# EAGLE design Gooligum_BaseDev_r16 (EAGLE 5.11)

## Sheet 1 of 4
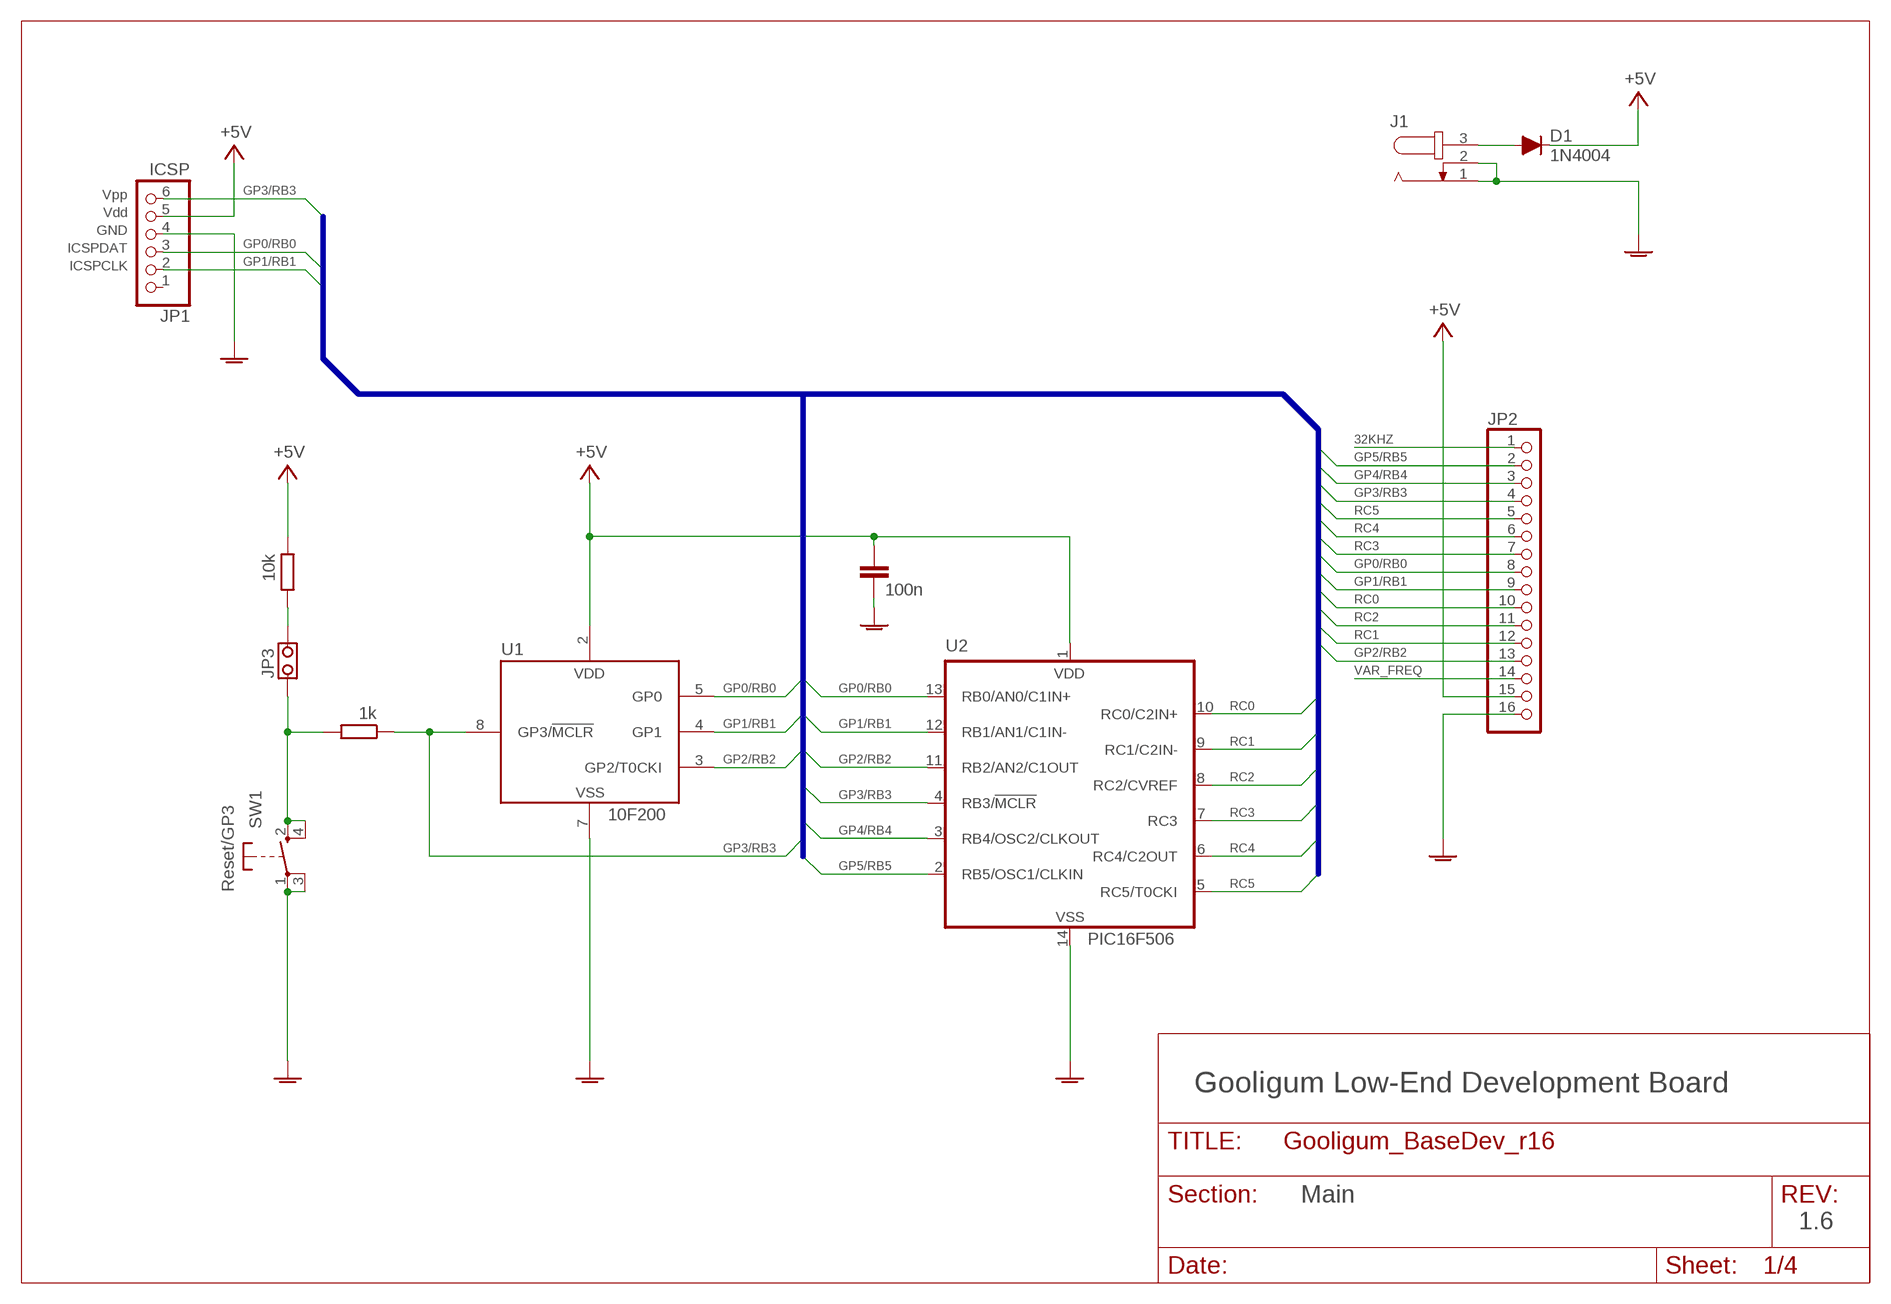
[diagram p0: schematic, sheet 1]

### Parts
C1  100n  C-EU050-024X044  [C050-024X044]
D1  1N4004  [DO41-10]
J1  JACK-PLUG0  [SPC4077]
JP1  ICSP  PINHD-1X6/90  [1X06/90]
JP2  PINHD-1X16  [1X16]
JP3  JP1Q  [JP1]
R1  10k  R-EU_0204/7  [0204/7]
R2  1k  R-EU_0204/7  [0204/7]
SW1  ETLS  [ELTS-6]
U1  10F200  PIC10F200-I/P  [DIL8]
U2  PIC16F506  PIC16F506-I/P  [DIL14]

### Nets
32KHZ: JP2.1 ; also sheet 3
+5V: C1.1 D1.C JP1.5 JP2.15 R1.1 U1.2(VDD1) U2.1(VDD) ; also sheet 2,3,4
GND: C1.2 J1.1 J1.2 JP1.4 JP2.16 SW1.1(T1) SW1.3(T3) U1.7(VSS1) U2.14(VSS) ; supply symbol labelled GNDA ; also sheet 2,3,4
GP0/RB0: JP1.3 JP2.8 U1.5(GP0) U2.13(RB0/AN0/C1IN+) ; also sheet 2,4
GP1/RB1: JP1.2 JP2.9 U1.4(GP1) U2.12(RB1/AN1/C1IN-) ; also sheet 2,4
GP2/RB2: JP2.13 U1.3(GP2/T0CKI) U2.11(RB2/AN2/C1OUT) ; also sheet 2,3,4
GP3/RB3: JP1.6 JP2.4 R2.1 U1.8(GP3/!MCLR) U2.4(RB3/!MCLR)
GP4/RB4: JP2.3 U2.3(RB4/OSC2/CLKOUT) ; also sheet 2,3,4
GP5/RB5: JP2.2 U2.2(RB5/OSC1/CLKIN) ; also sheet 2,3
N$1: JP3.1 R2.2 SW1.2(T2) SW1.4(T4)
N$5: JP3.2 R1.2
N$55: D1.A J1.3
RC0: JP2.10 U2.10(RC0/C2IN+) ; also sheet 2,4
RC1: JP2.12 U2.9(RC1/C2IN-) ; also sheet 2
RC2: JP2.11 U2.8(RC2/CVREF) ; also sheet 2
RC3: JP2.7 U2.7(RC3) ; also sheet 2
RC4: JP2.6 U2.6(RC4/C2OUT) ; also sheet 2,4
RC5: JP2.5 U2.5(RC5/T0CKI) ; also sheet 2,4
VAR_FREQ: JP2.14 ; also sheet 4
Unconnected: JP1.1

### Buses
GP0/RB0,GP1/RB1,GP2/RB2,GP3/RB3,GP4/RB4,GP5/RB5,RC0,RC1,RC2,RC3,RC4,RC5

### Notes on the sheet
- Vpp
- Vdd
- GND
- ICSPDAT
- ICSPCLK
- Reset/GP3
- Gooligum Low-End Development Board
- Main
- 1.6

## Sheet 2 of 4
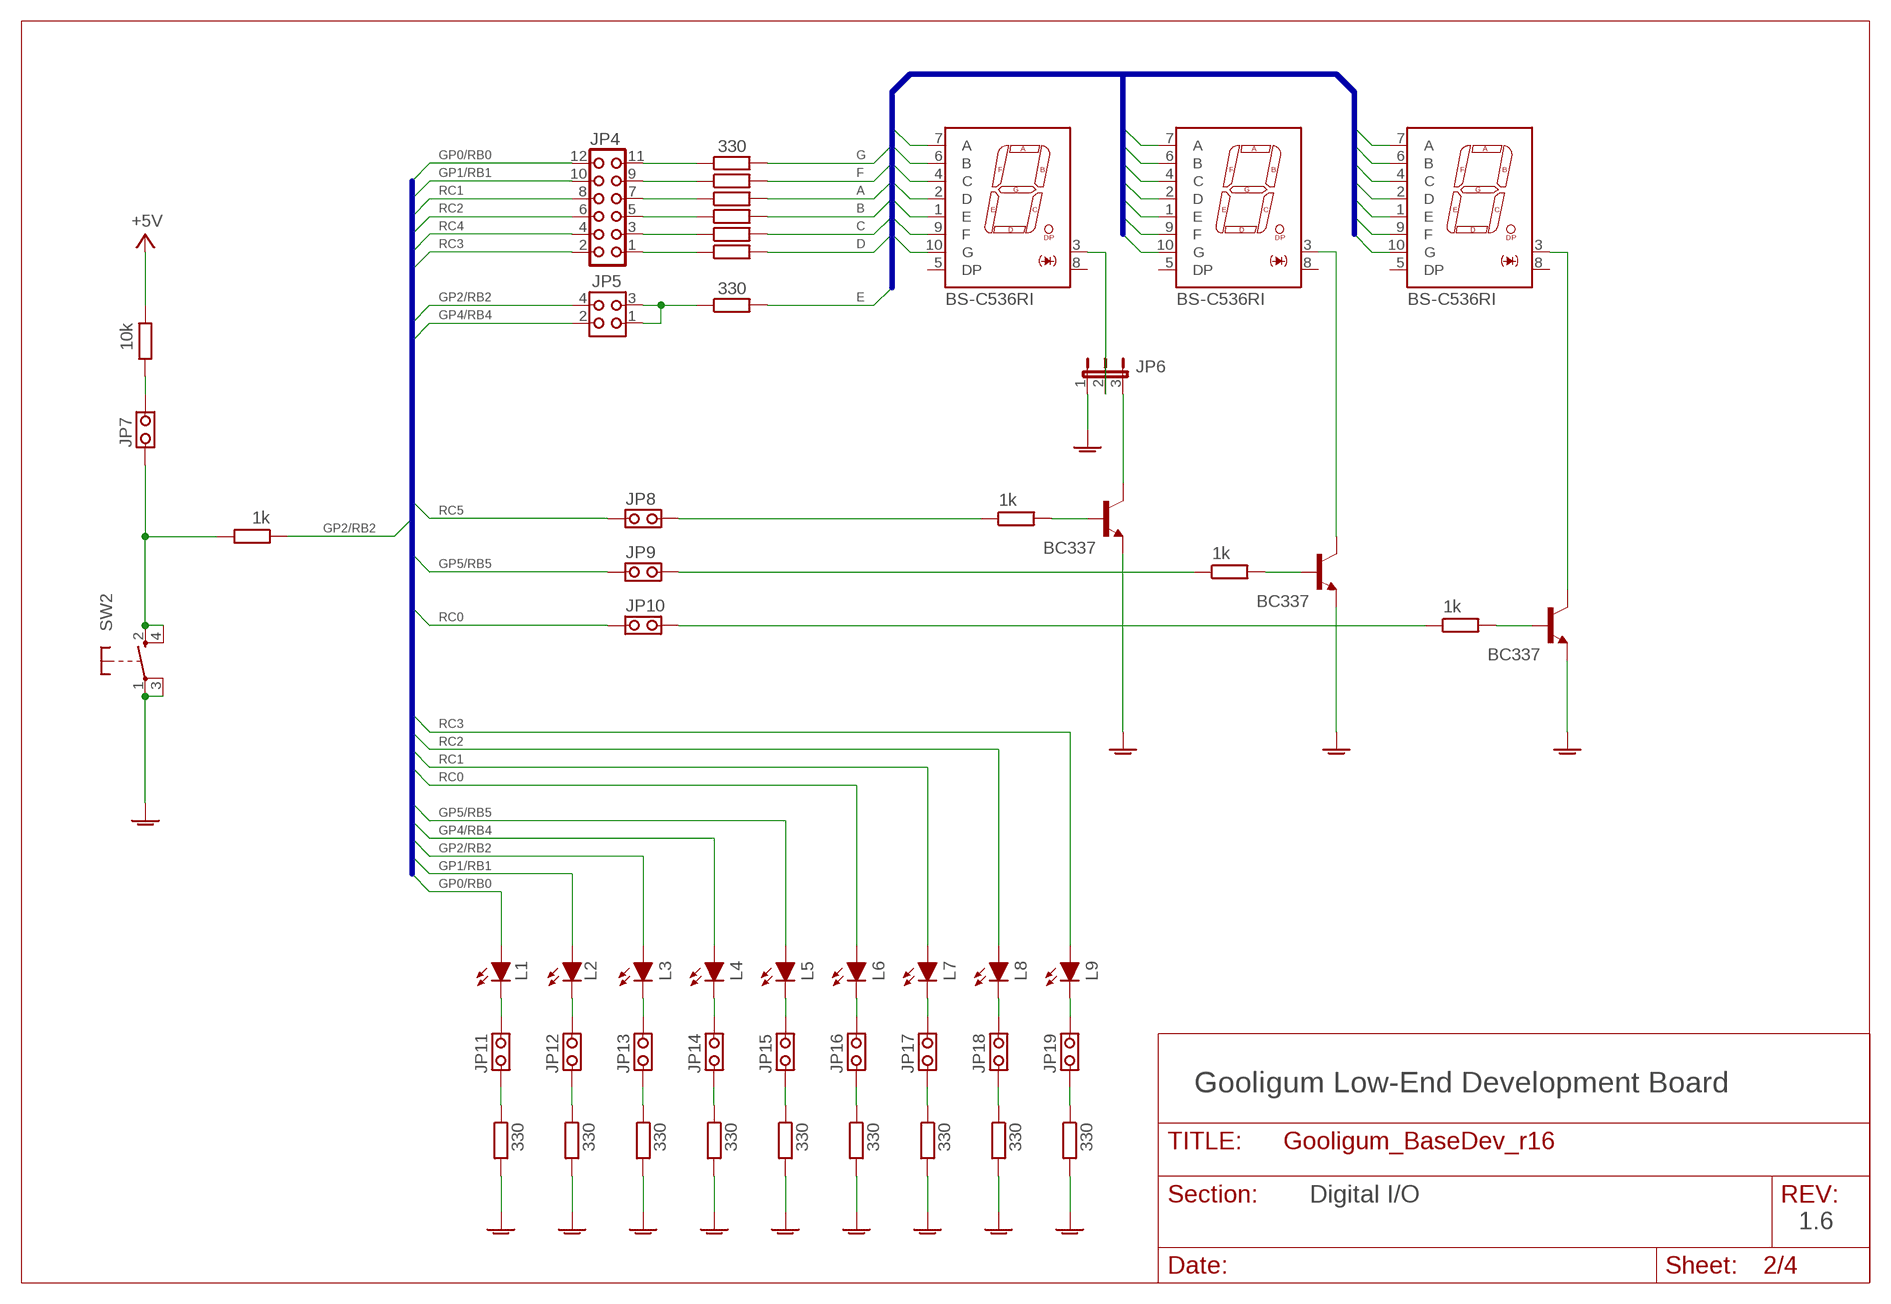
[diagram p1: schematic, sheet 2]

### Parts
DSP1  BS-C536RI  [BS-C536RI]
DSP2  BS-C536RI  [BS-C536RI]
DSP3  BS-C536RI  [BS-C536RI]
JP4  JP6Q  [JP6Q]
JP5  JP2Q  [JP2Q]
JP6  JP2E  [JP2]
JP7  JP1Q  [JP1]
JP8  JP1Q  [JP1]
JP9  JP1Q  [JP1]
JP10  JP1Q  [JP1]
JP11  JP1Q  [JP1]
JP12  JP1Q  [JP1]
JP13  JP1Q  [JP1]
JP14  JP1Q  [JP1]
JP15  JP1Q  [JP1]
JP16  JP1Q  [JP1]
JP17  JP1Q  [JP1]
JP18  JP1Q  [JP1]
JP19  JP1Q  [JP1]
L1  LED5MM  [LED5MM]
L2  LED5MM  [LED5MM]
L3  LED5MM  [LED5MM]
L4  LED5MM  [LED5MM]
L5  LED5MM  [LED5MM]
L6  LED5MM  [LED5MM]
L7  LED5MM  [LED5MM]
L8  LED5MM  [LED5MM]
L9  LED5MM  [LED5MM]
Q1  BC337  BC548  [TO92-EBC]
Q2  BC337  BC548  [TO92-EBC]
Q3  BC337  BC548  [TO92-EBC]
R3  330  R-EU_0204/7  [0204/7]
R4  330  R-EU_0204/7  [0204/7]
R5  330  R-EU_0204/7  [0204/7]
R6  330  R-EU_0204/7  [0204/7]
R7  330  R-EU_0204/7  [0204/7]
R8  330  R-EU_0204/7  [0204/7]
R9  330  R-EU_0204/7  [0204/7]
R10  10k  R-EU_0204/7  [0204/7]
R11  1k  R-EU_0204/7  [0204/7]
R12  1k  R-EU_0204/7  [0204/7]
R13  1k  R-EU_0204/7  [0204/7]
R14  1k  R-EU_0204/7  [0204/7]
R15  330  R-EU_0204/7  [0204/7]
R16  330  R-EU_0204/7  [0204/7]
R17  330  R-EU_0204/7  [0204/7]
R18  330  R-EU_0204/7  [0204/7]
R19  330  R-EU_0204/7  [0204/7]
R20  330  R-EU_0204/7  [0204/7]
R21  330  R-EU_0204/7  [0204/7]
R22  330  R-EU_0204/7  [0204/7]
R23  330  R-EU_0204/7  [0204/7]
SW2  ETLS  [ELTS-6]

### Nets
+5V: R10.1 ; also sheet 1,3,4
A: DSP1.7(A) DSP2.7(A) DSP3.7(A) R5.2
B: DSP1.6(B) DSP2.6(B) DSP3.6(B) R6.2
C: DSP1.4(C) DSP2.4(C) DSP3.4(C) R7.2
D: DSP1.2(D) DSP2.2(D) DSP3.2(D) R8.2
E: DSP1.1(E) DSP2.1(E) DSP3.1(E) R9.2
F: DSP1.9(F) DSP2.9(F) DSP3.9(F) R4.2
G: DSP1.10(G) DSP2.10(G) DSP3.10(G) R3.2
GND: JP6.1 Q1.E Q2.E Q3.E R15.2 R16.2 R17.2 R18.2 R19.2 R20.2 R21.2 R22.2 R23.2 SW2.1(T1) SW2.3(T3) ; supply symbol labelled GNDA ; also sheet 1,3,4
GP0/RB0: JP4.12 L1.A ; also sheet 1,4
GP1/RB1: JP4.10 L2.A ; also sheet 1,4
GP2/RB2: JP5.4 L3.A R12.1 ; also sheet 1,3,4
GP4/RB4: JP5.2 L4.A ; also sheet 1,3,4
GP5/RB5: JP9.1 L5.A ; also sheet 1,3
N$2: JP11.1 L1.K(C)
N$3: JP12.1 L2.K(C)
N$4: JP7.1 R12.2 SW2.2(T2) SW2.4(T4)
N$6: JP13.1 L3.K(C)
N$7: JP11.2 R15.1
N$8: JP12.2 R16.1
N$9: JP13.2 R17.1
N$10: JP7.2 R10.2
N$19: JP4.11 R3.1
N$20: JP4.9 R4.1
N$21: JP4.7 R5.1
N$22: JP4.5 R6.1
N$23: JP4.3 R7.1
N$24: JP4.1 R8.1
N$25: JP5.1 JP5.3 R9.1
N$26: DSP1.3(K) JP6.2
N$27: JP6.3 Q1.C
N$28: JP8.2 R11.1
N$29: Q1.B R11.2
N$30: DSP2.3(K) Q2.C
N$31: JP9.2 R13.1
N$32: Q2.B R13.2
N$33: DSP3.3(K) Q3.C
N$34: JP10.2 R14.1
N$35: Q3.B R14.2
N$38: JP16.1 L6.K(C)
N$39: JP16.2 R20.1
N$40: JP17.1 L7.K(C)
N$41: JP17.2 R21.1
N$42: JP18.1 L8.K(C)
N$43: JP18.2 R22.1
N$44: JP19.1 L9.K(C)
N$45: JP19.2 R23.1
N$46: JP14.2 R18.1
N$47: JP14.1 L4.K(C)
N$48: JP15.2 R19.1
N$49: JP15.1 L5.K(C)
RC0: JP10.1 L6.A ; also sheet 1,4
RC1: JP4.8 L7.A ; also sheet 1
RC2: JP4.6 L8.A ; also sheet 1
RC3: JP4.2 L9.A ; also sheet 1
RC4: JP4.4 ; also sheet 1,4
RC5: JP8.1 ; also sheet 1,4
Unconnected: DSP1.5(DP) DSP1.8(K) DSP2.5(DP) DSP2.8(K) DSP3.5(DP) DSP3.8(K)

### Buses
GP0/RB0,GP1/RB1,GP2/RB2,GP3/RB3,GP4/RB4,GP5/RB5,RC0,RC1,RC2,RC3,RC4,RC5
A,B,C,D,E,F,G

### Notes on the sheet
- Gooligum Low-End Development Board
- Digital I/O
- 1.6

## Sheet 3 of 4
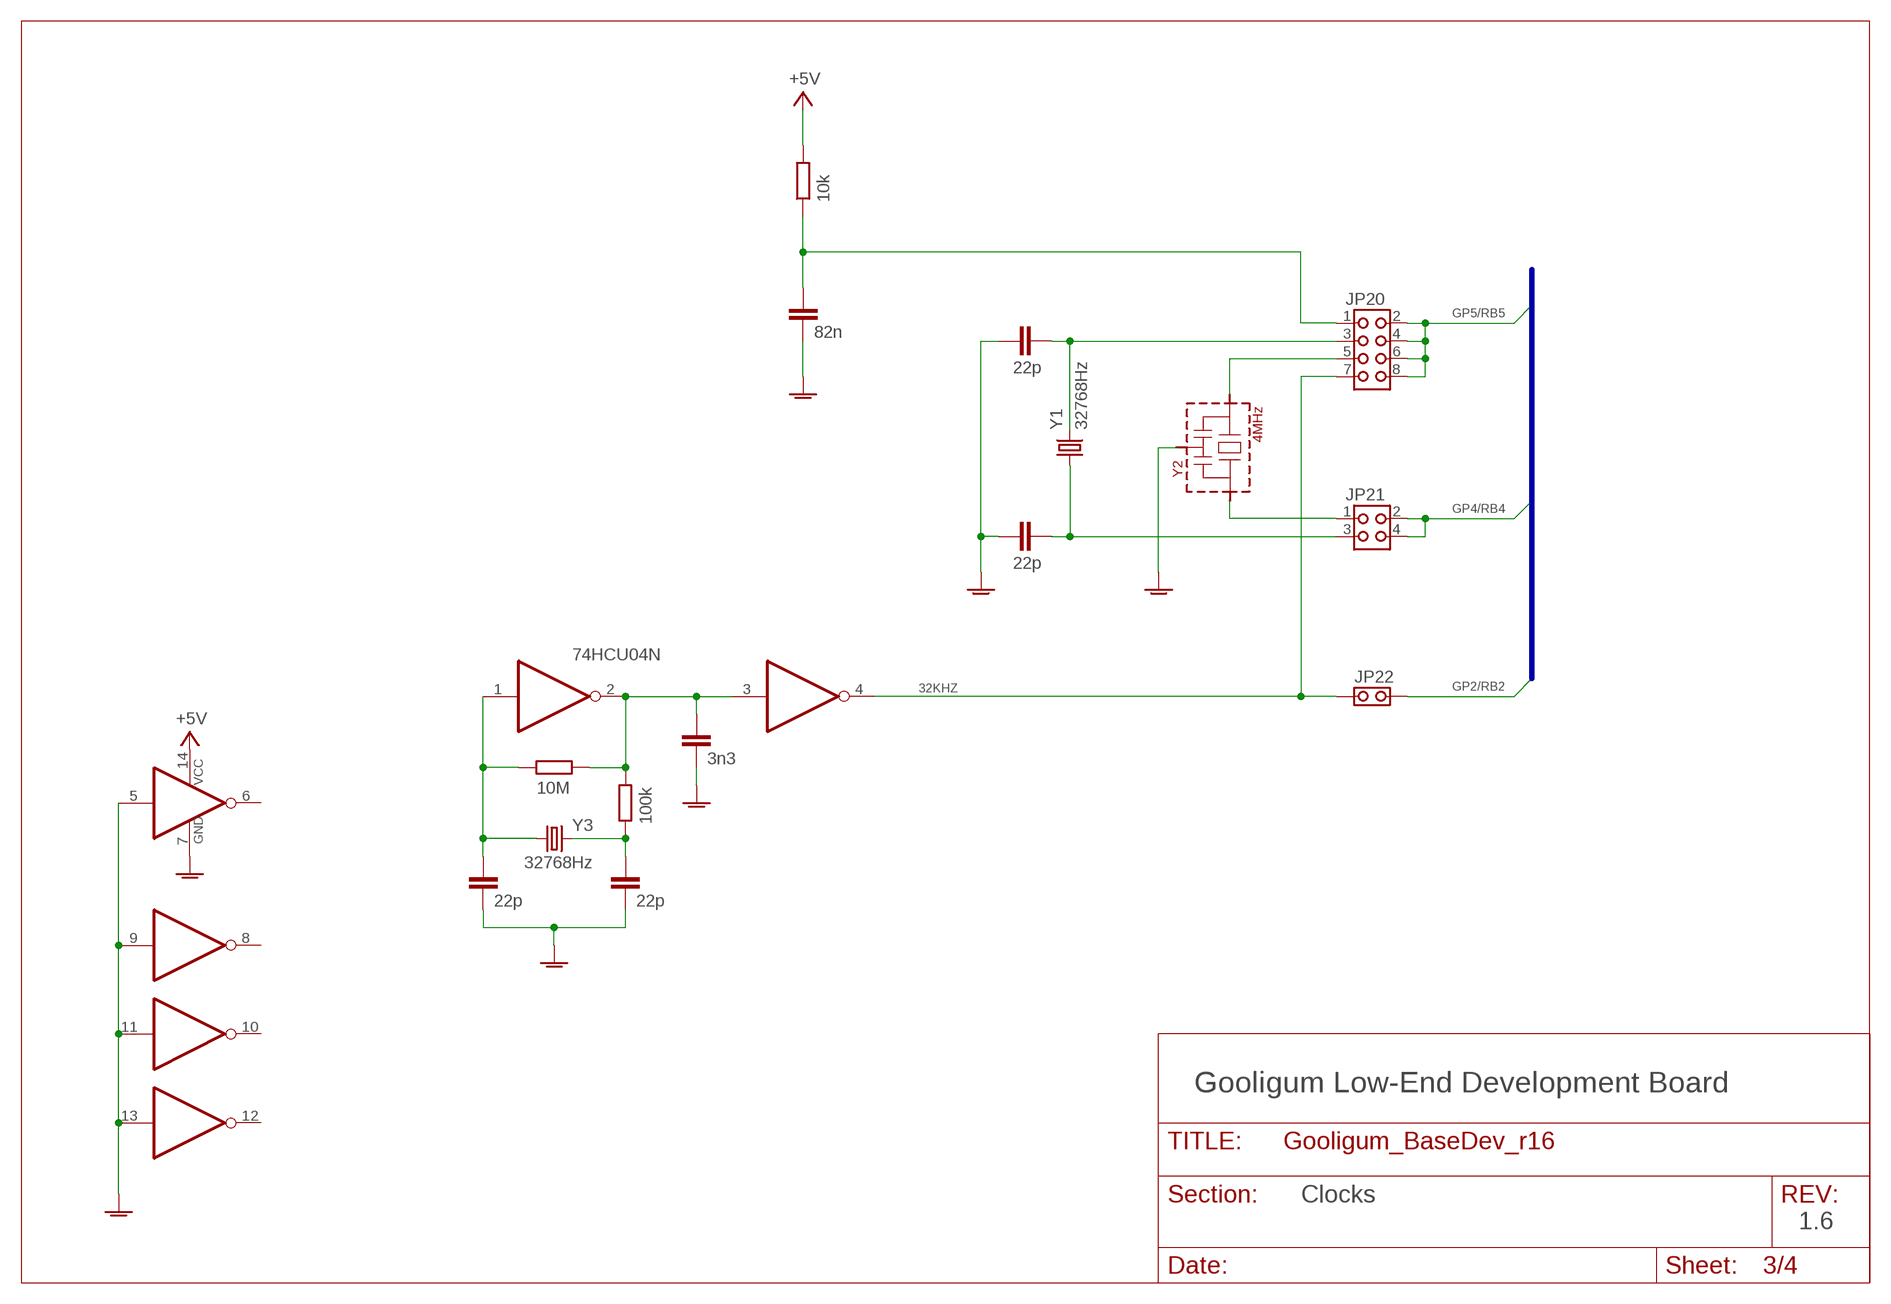
[diagram p2: schematic, sheet 3]

### Parts
C2  82n  C-EU050-025X075  [C050-025X075]
C3  22p  C-EU025-025X050  [C025-025X050]
C4  22p  C-EU025-025X050  [C025-025X050]
C5  3n3  C-EU050-025X075  [C050-025X075]
C6  22p  C-EU025-025X050  [C025-025X050]
C7  22p  C-EU025-025X050  [C025-025X050]
IC1  74HCU04N  74HC04N  [DIL14]
JP20  JP4Q  [JP4Q]
JP21  JP2Q  [JP2Q]
JP22  JP1Q  [JP1]
R24  10k  R-EU_0204/7  [0204/7]
R25  10M  R-EU_0204/7  [0204/7]
R26  100k  R-EU_0204/7  [0204/7]
Y1  32768Hz  CRYSTALTC26H  [TC26H]
Y2  4MHz  CSTLS_G*  [CSTLS_G9]
Y3  32768Hz  CRYSTALTC26H  [TC26H]

### Nets
32KHZ: IC1.4(B:O) JP20.7 JP22.1 ; also sheet 1
+5V: IC1.14(P:VCC) R24.2 ; also sheet 1,2,4
GND: C2.2 C3.1 C4.1 C5.2 C6.2 C7.2 IC1.5(C:I) IC1.7(P:GND) IC1.9(D:I) IC1.11(E:I) IC1.13(F:I) Y2.2(VSS) ; supply symbol labelled GNDA ; also sheet 1,2,4
GP2/RB2: JP22.2 ; also sheet 1,2,4
GP4/RB4: JP21.2 JP21.4 ; also sheet 1,2,4
GP5/RB5: JP20.2 JP20.4 JP20.6 JP20.8 ; also sheet 1,2
N$11: C5.1 IC1.2(A:O) IC1.3(B:I) R25.2 R26.2
N$12: C6.1 IC1.1(A:I) R25.1 Y3.1
N$13: C7.1 R26.1 Y3.2
N$14: C4.2 JP21.3 Y1.1
N$15: C2.1 JP20.1 R24.1
N$16: C3.2 JP20.3 Y1.2
N$17: JP21.1 Y2.3
N$18: JP20.5 Y2.1
Unconnected: IC1.6(C:O) IC1.8(D:O) IC1.10(E:O) IC1.12(F:O)

### Buses
GP0/RB0,GP1/RB1,GP2/RB2,GP3/RB3,GP4/RB4,GP5/RB5,RC0,RC1,RC2,RC3,RC4,RC5

### Notes on the sheet
- Gooligum Low-End Development Board
- Clocks
- 1.6

## Sheet 4 of 4
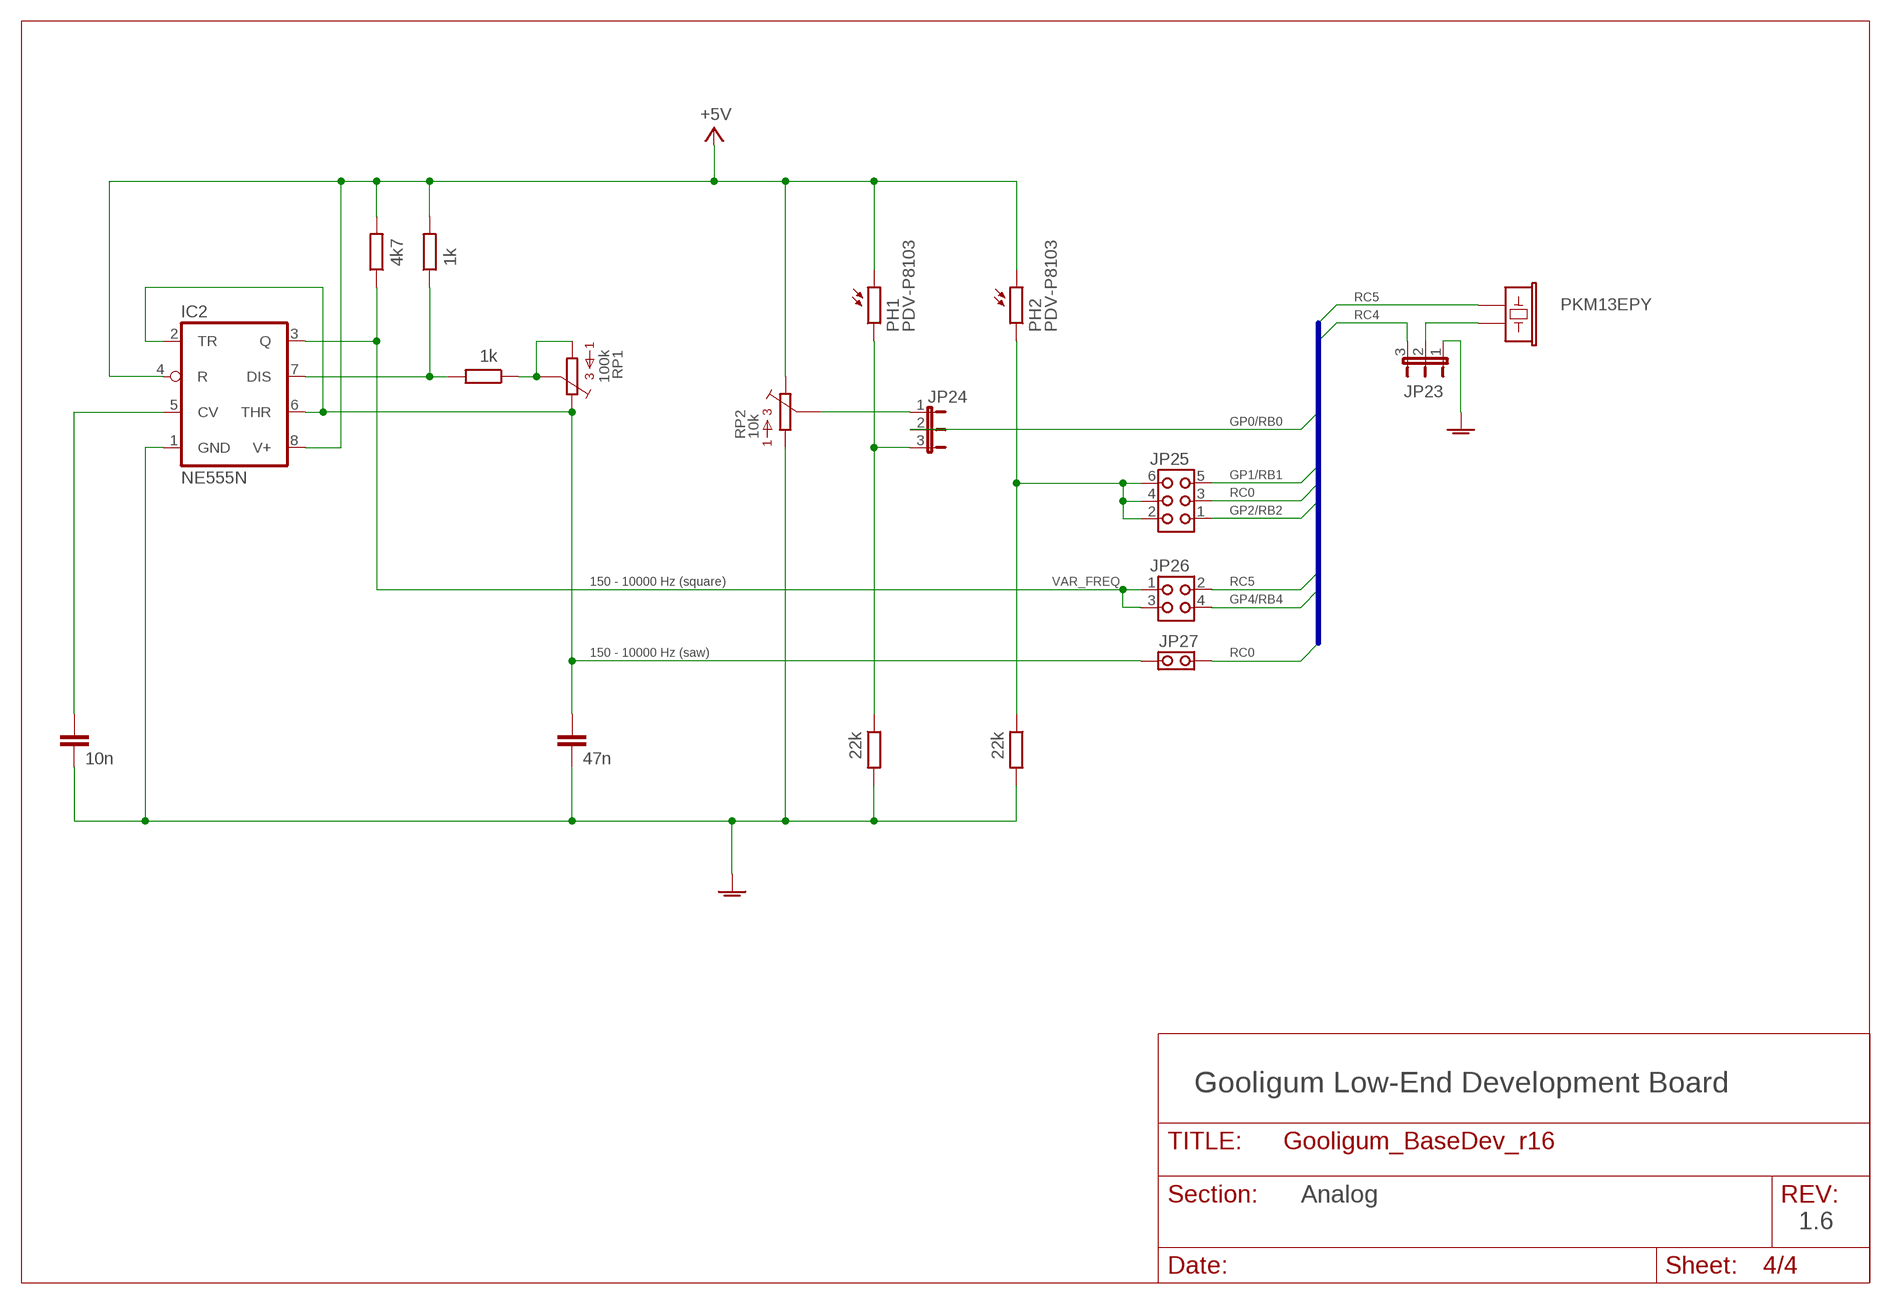
[diagram p3: schematic, sheet 4]

### Parts
C8  10n  C-EU025-025X050  [C025-025X050]
C9  47n  C-EU025-025X050  [C025-025X050]
IC2  NE555N  [DIL08]
JP23  JP2E  [JP2]
JP24  JP2E  [JP2]
JP25  JP3Q  [JP3Q]
JP26  JP2Q  [JP2Q]
JP27  JP1Q  [JP1]
PH1  PDV-P8103  [PDV-P8103]
PH2  PDV-P8103  [PDV-P8103]
R27  4k7  R-EU_0204/7  [0204/7]
R28  1k  R-EU_0204/7  [0204/7]
R29  1k  R-EU_0204/7  [0204/7]
R30  22k  R-EU_0204/7  [0204/7]
R31  22k  R-EU_0204/7  [0204/7]
RP1  100k  3352T  [3352T]
RP2  10k  3352T  [3352T]
SP1  PKM13EPY  [PKM13EPY]

### Nets
+5V: IC2.4(R) IC2.8(V+) PH1.1 PH2.1 R27.2 R28.2 RP2.P$3 ; also sheet 1,2,3
GND: C8.2 C9.2 IC2.1(GND) JP23.1 R30.2 R31.2 RP2.P$1 ; also sheet 1,2,3
GP0/RB0: JP24.2 ; also sheet 1,2
GP1/RB1: JP25.5 ; also sheet 1,2
GP2/RB2: JP25.1 ; also sheet 1,2,3
GP4/RB4: JP26.4 ; also sheet 1,2,3
N$36: JP24.3 PH1.2 R30.1
N$37: JP24.1 RP2.P$2
N$50: JP23.2 SP1.P$2
N$51: JP25.2 JP25.4 JP25.6 PH2.2 R31.1
N$52: C8.1 IC2.5(CV)
N$53: R29.1 RP1.P$1 RP1.P$2
N$54: C9.1 IC2.2(TR) IC2.6(THR) JP27.1 RP1.P$3
N$56: IC2.7(DIS) R28.1 R29.2
RC0: JP25.3 JP27.2 ; also sheet 1,2
RC4: JP23.3 ; also sheet 1,2
RC5: JP26.2 SP1.P$1 ; also sheet 1,2
VAR_FREQ: IC2.3(Q) JP26.1 JP26.3 R27.1 ; also sheet 1

### Buses
GP0/RB0,GP1/RB1,GP2/RB2,GP3/RB3,GP4/RB4,GP5/RB5,RC0,RC1,RC2,RC3,RC4,RC5

### Notes on the sheet
- 150 - 10000 Hz (square)
- 150 - 10000 Hz (saw)
- Gooligum Low-End Development Board
- Analog
- 1.6

## Library data of the parts
C1 = resistor:C-EU: CAPACITOR, European symbol
C2-C9 = rcl:C-EU: CAPACITOR, European symbol
D1 = diode:1N4004: DIODE general purpose rectifier, 1 A
DSP1-DSP3 = led:BS-C536RI: Bright LED Electronics Corp BS-C536R1 0.52inch 7-segment display Direct drive common cathode
IC1 = 74xx-eu:74*04: Hex INVERTER
IC2 = linear:*555: TIMER
J1 = con-jack_short-slots:JACK-PLUG: DC POWER JACK Power Jack, DC, Right Angle, Through Hole, Rated 5A at 16VDC, PC Terminals Distributor: Farnell (www.Farnell.de) Drawing: 84N1161.pdf / 84N1162.pdf Manufacturer: SPC Technology (www.spctechnology.com) Type: SPC4077 / SPC 4078; OC_FARNELL: unknown; OC_NEWARK: unknown
JP1 = pinhead_thinpads:PINHD-1X6: PIN HEADER
JP2 = pinhead_thinpads:PINHD-1X16: PIN HEADER
JP3 JP7-JP19 JP22 JP27 = jumper:JP1Q: JUMPER
JP4 = jumper:JP6Q: JUMPER
JP5 JP21 JP26 = jumper:JP2Q: JUMPER
JP6 JP23 JP24 = jumper:JP2E: JUMPER
JP20 = jumper:JP4Q: JUMPER
JP25 = jumper:JP3Q: JUMPER
L1-L9 = led:LED: LED OSRAM: - CHIPLED LG R971, LG N971, LY N971, LG Q971, LY Q971, LO R971, LY R971 LH N974, LH R974 LS Q976, LO Q976, LY Q976 LO Q996 - Hyper CHIPLED LW Q18S LB Q993, LB Q99A, LB R99A - SideLED LS A670, LO A670, LY A670, LG A670, LP A670 LB A673, LV A673, LT A673, LW A673 LH A674 LY A675 LS A676, LA A676, LO A676, LY A676, LW A676 LS A679, LY A679, LG A679 - Hyper Micro SIDELED® LS Y876, LA Y876, LO Y876, LY Y876 LT Y87S - SmartLED LW L88C, LW L88S LB L89C, LB L89S, LG L890 LS L89K, LO L89K, LY L89K LS L896, LA L896, LO L896, LY L896 - TOPLED LS T670, LO T670, LY T670, LG T670, LP T670 LSG T670, LSP T670, LSY T670, LOP T670, LYG T670 LG T671, LOG T671, LSG T671 LB T673, LV T673, LT T673, LW T673 LH T674 LS T676, LA T676, LO T676, LY T676, LB T676, LH T676, LSB T676, LW T676 LB T67C, LV T67C, LT T67C, LS T67K, LO T67K, LY T67K, LW E67C LS E67B, LA E67B, LO E67B, LY E67B, LB E67C, LV E67C, LT E67C LW T67C LS T679, LY T679, LG T679 LS T770, LO T770, LY T770, LG T770, LP T770 LB T773, LV T773, LT T773, LW T773 LH T774 LS E675, LA E675, LY E675, LS T675 LS T776, LA T776, LO T776, LY T776, LB T776 LHGB T686 LT T68C, LB T68C - Hyper Mini TOPLED® LB M676 - Mini TOPLED Santana® LG M470 LS M47K, LO M47K, LY M47K Source: http://www.osram.convergy.de/
PH1 PH2 = photocell-EU:PDV-P8103: Advanced Photonix PDV-P8103
Q1-Q3 = transistor-npn:BC548*: NPN Transistor
R1-R31 = rcl:R-EU_: RESISTOR, European symbol
RP1 RP2 = BOURNS:3352: Bourns 3352 3/8" thumbwheel trimpots
SP1 = buzzer-murata:PKM13EPY
SW1 SW2 = switch-salecom:ETLS: PCB mount tact pushbutton switch
U1 = PIC10F20x:PIC10F20*: Microchip PIC10F200 and 10F202
U2 = pic16f6xx_14pin:PIC16F506
Y1 Y3 = crystal:CRYSTAL: CRYSTAL
Y2 = murata-resonators:CSTLS_G: Ceramic resonator 2.00 to 10.00 MHz

## Board
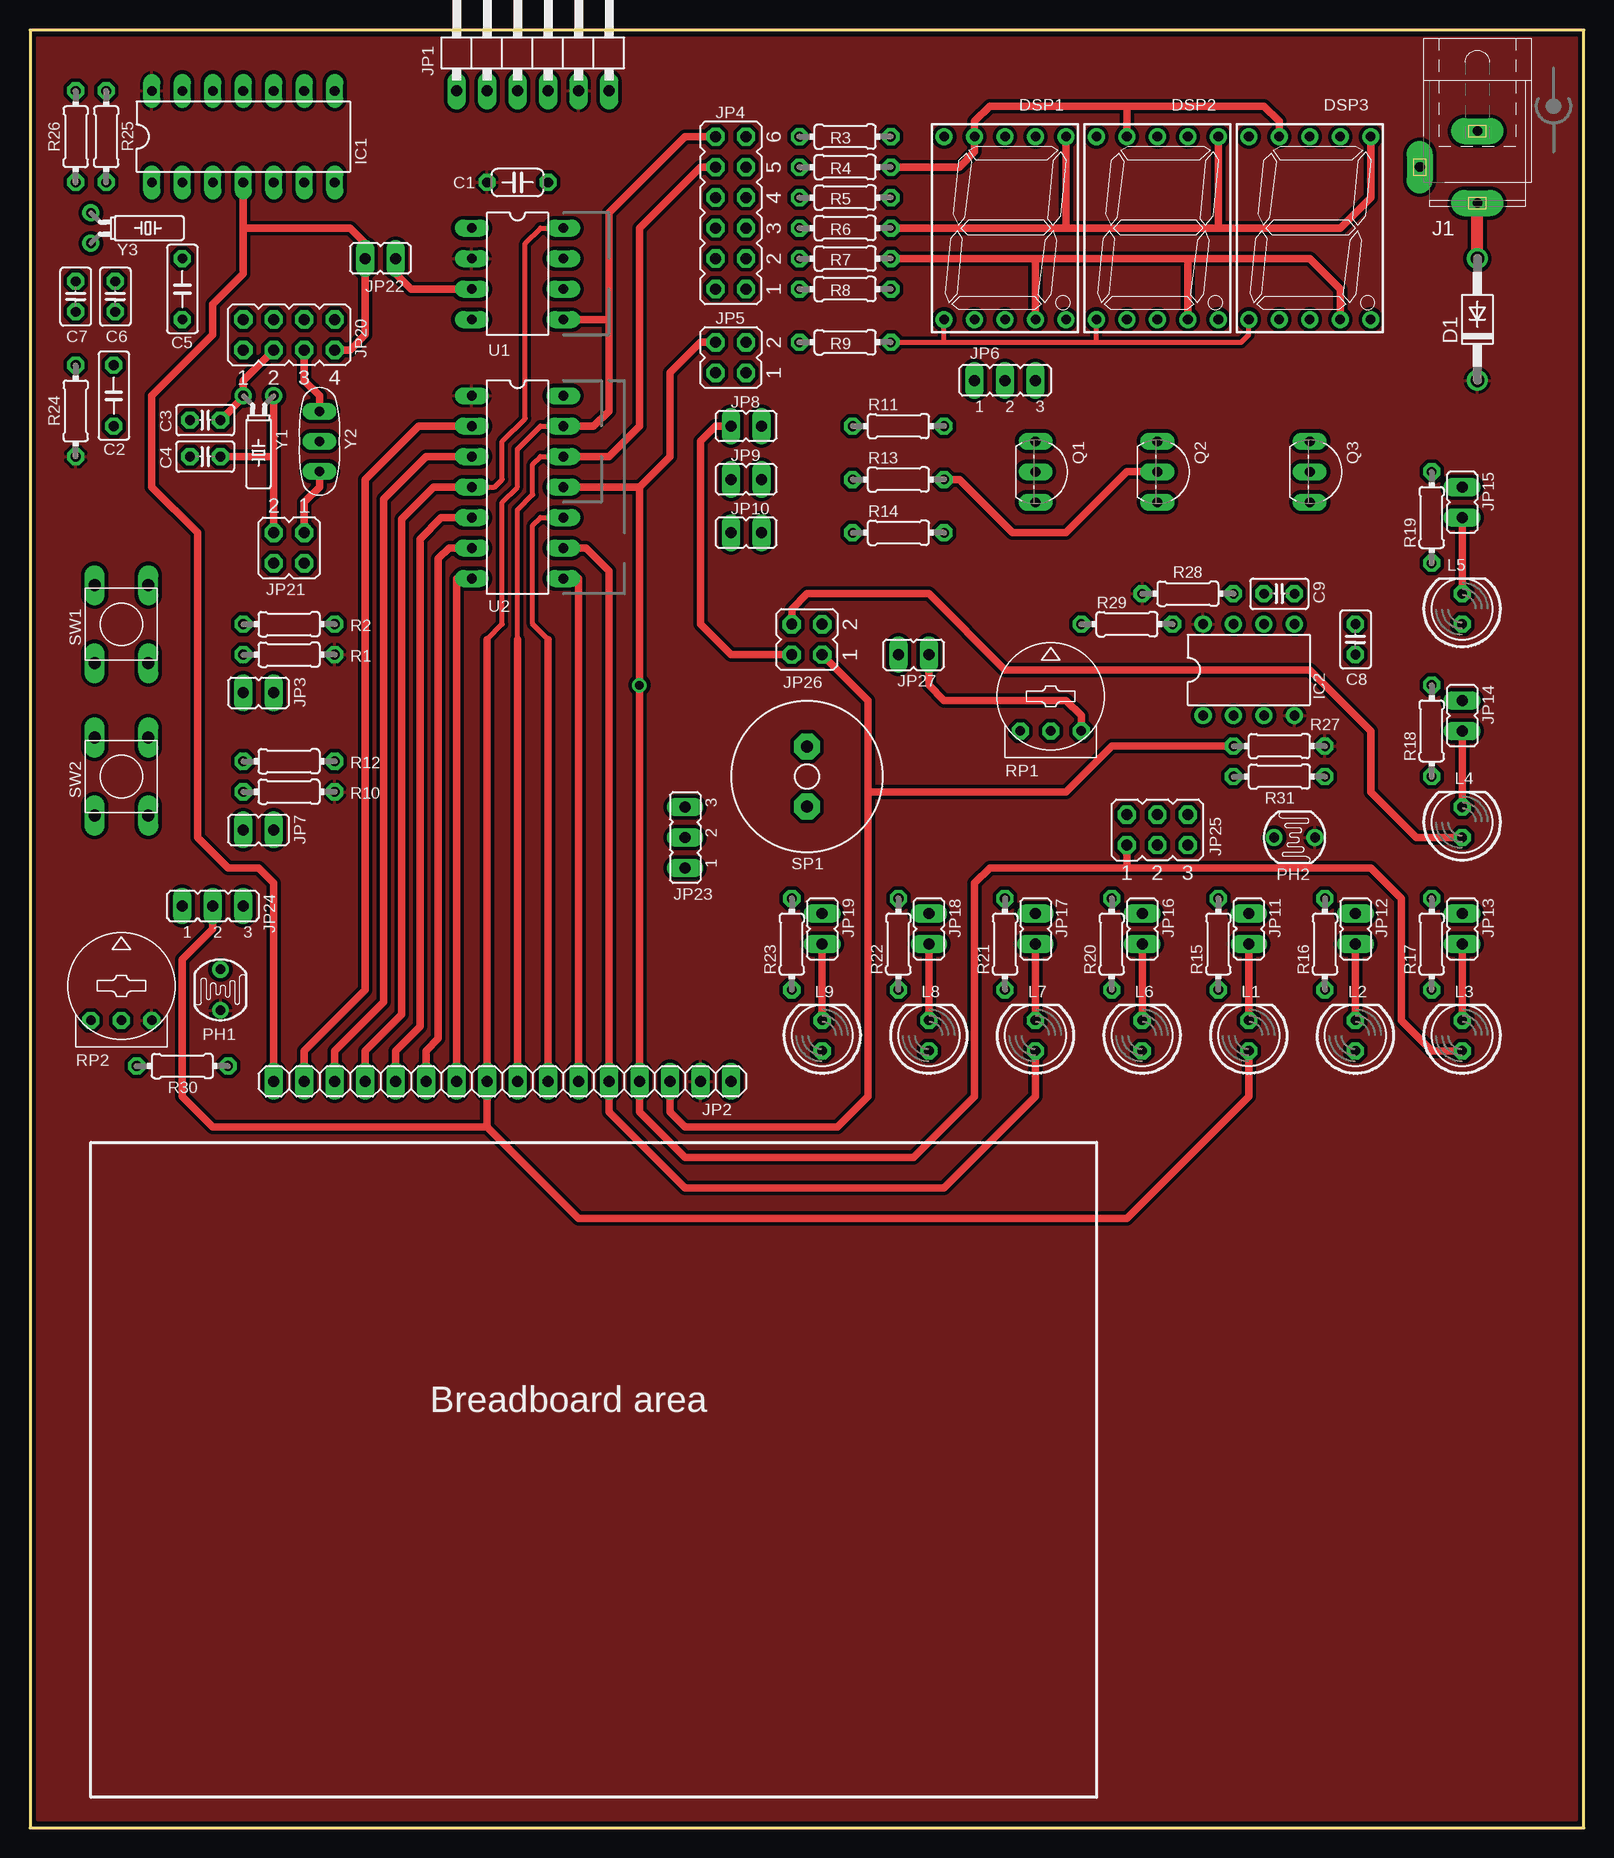
[diagram p4: board, top side]
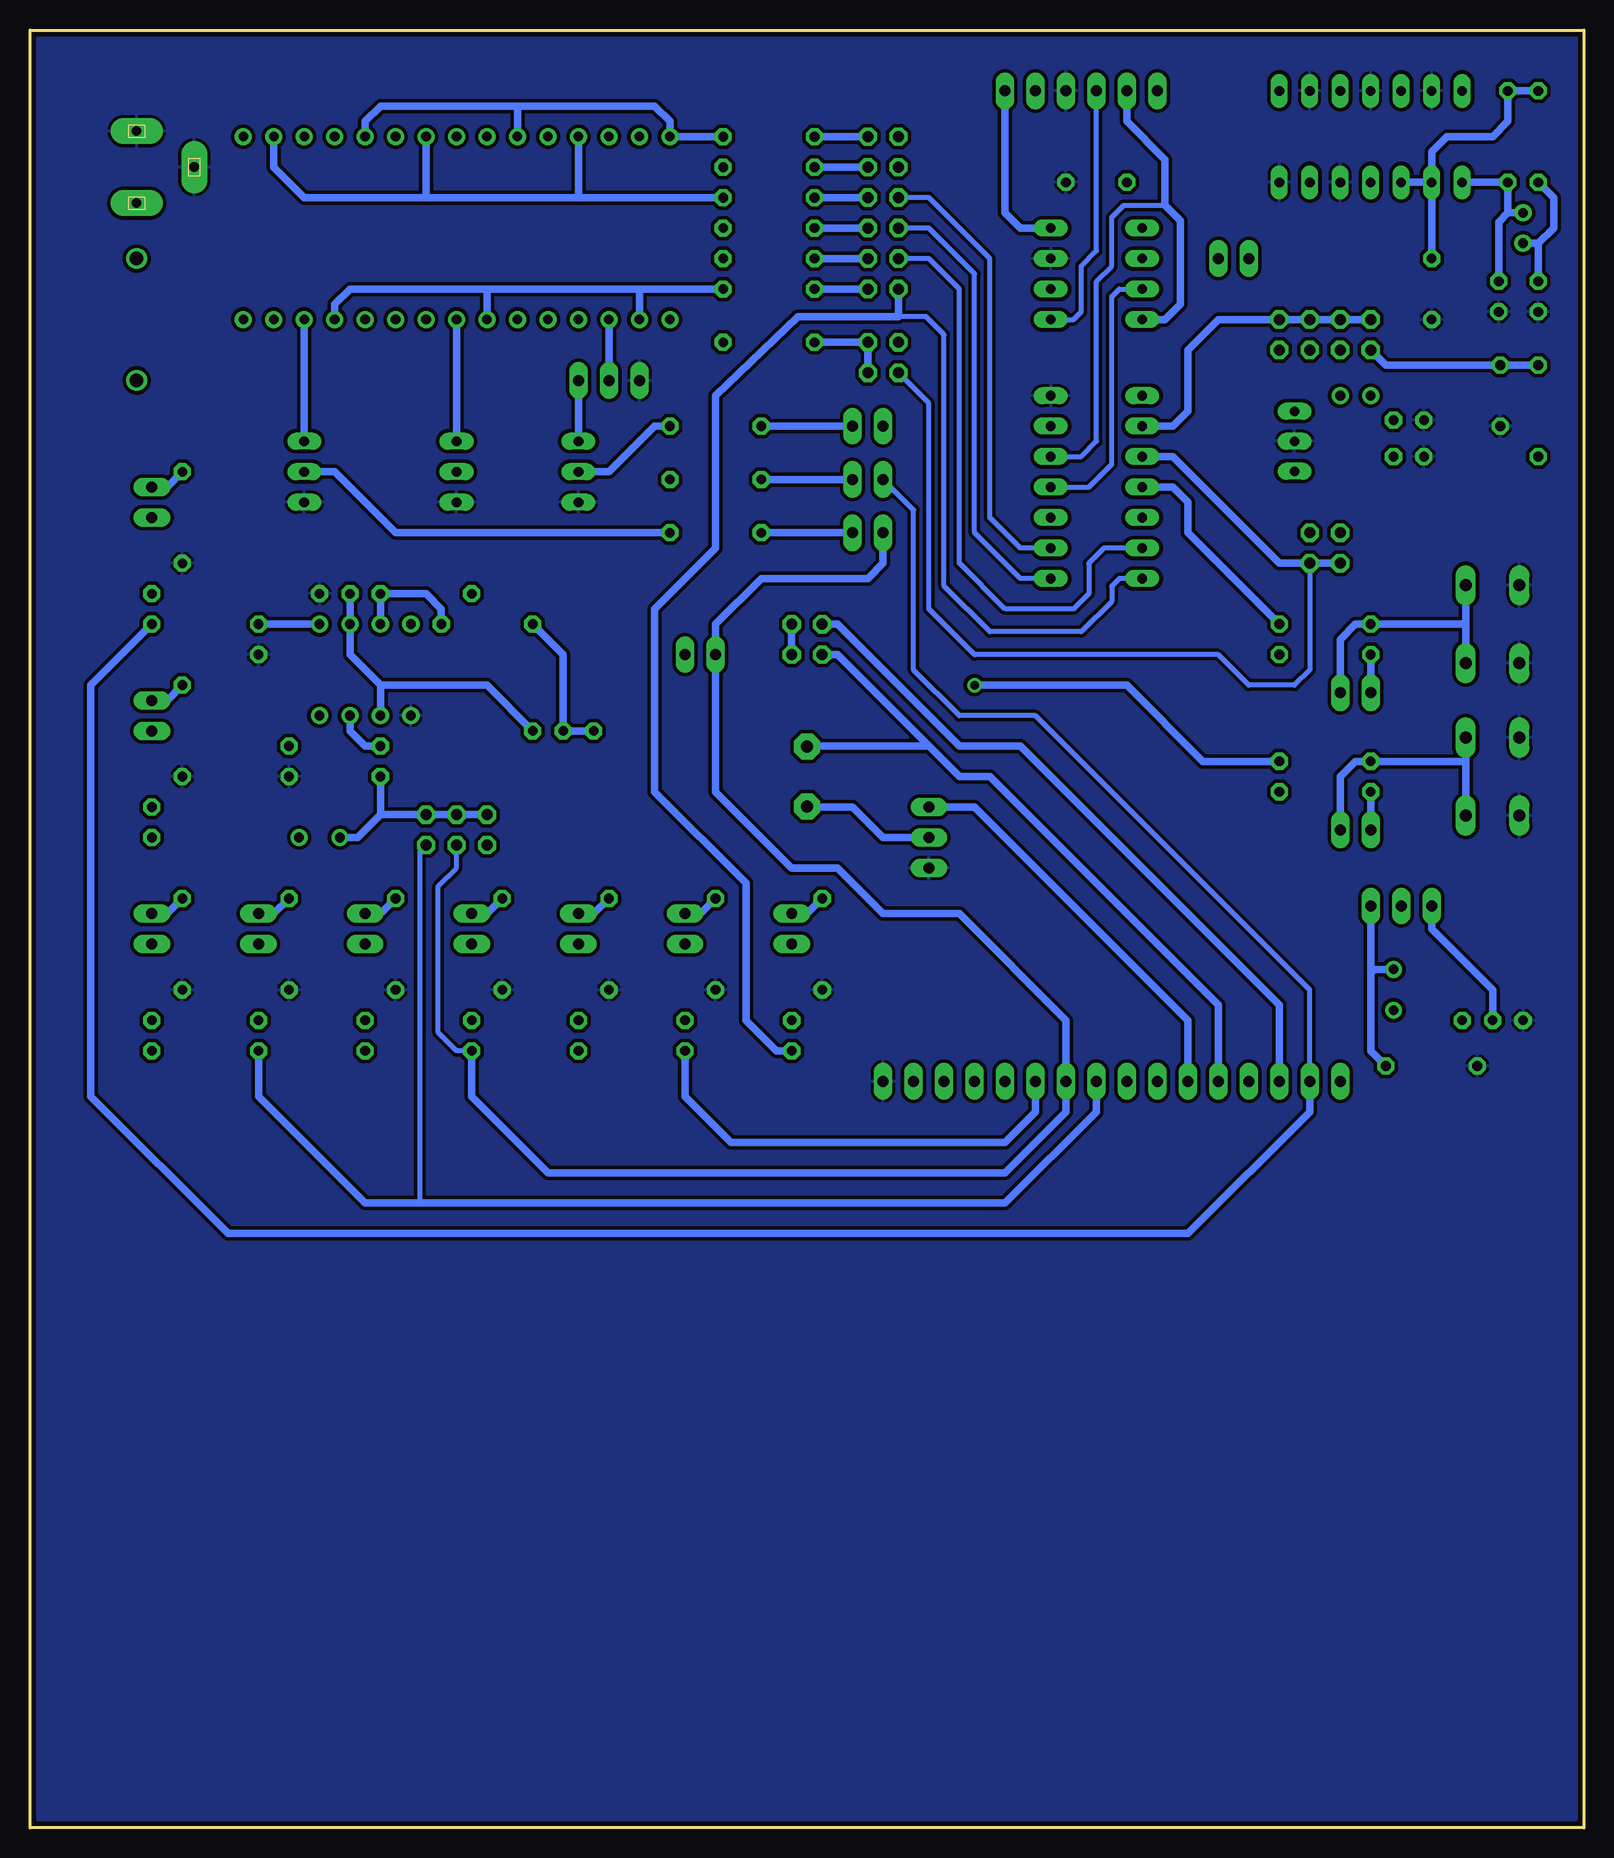
[diagram p5: board, bottom side, seen from below]

Size 129.54 x 149.86 mm. Coordinates in mm from the lower left corner, seen from the top.
Outline: 0,0 129.54,0 129.54,149.86 0,149.86 0,0
Copper layers (1*16): Top 0.035mm / dielectric 1.5mm / Bottom 0.035mm
Design rules "SparkFun": minimum track width 8mil, minimum drill 20mil, track to track 8mil, track to pad 8mil, pad to pad 8mil, via to via 8mil, smd to smd 8mil, copper to edge 10mil, drill to drill 8mil, minimum pad ring 12mil, minimum via ring 10mil, stop-mask expansion 4mil, vias tented up to drill 25mil, thermal gap 10mil

### Footprints (pad centres in the part's own frame; a part is rotated, then mirrored left to right if it is on the bottom)
C050-024X044 = drill 0.813 octagon: 1 -2.54,0; 2 2.54,0
C050-025X075 = drill 0.813 octagon: 1 -2.54,0; 2 2.54,0
C025-025X050 = drill 0.813 octagon: 1 -1.27,0; 2 1.27,0
DO41-10 = drill 1.118 round: A 5.08,0; C -5.08,0
BS-C536RI = drill 0.8 pad 1.27 round: 1 -5.08,-7.62; 2 -2.54,-7.62; 3 0,-7.62; 4 2.54,-7.62; 5 5.08,-7.62; 6 5.08,7.62; 7 2.54,7.62; 8 0,7.62; 9 -2.54,7.62; 10 -5.08,7.62
DIL14 = drill 0.813 long: 1 -7.62,-3.81; 2 -5.08,-3.81; 3 -2.54,-3.81; 4 0,-3.81; 5 2.54,-3.81; 6 5.08,-3.81; 7 7.62,-3.81; 8 7.62,3.81; 9 5.08,3.81; 10 2.54,3.81; 11 0,3.81; 12 -2.54,3.81; 13 -5.08,3.81; 14 -7.62,3.81
DIL08 = drill 0.813 pad 1.27 round: 1 -3.81,-3.81; 2 -1.27,-3.81; 3 1.27,-3.81; 4 3.81,-3.81; 5 3.81,3.81; 6 1.27,3.81; 7 -1.27,3.81; 8 -3.81,3.81
SPC4077 = drill 0.8 pad 2.184 long: 1 -3,0; 2 0,-4.8; 3 3,0
1X06/90 = drill 0.914 long: 1 -6.35,-3.81; 2 -3.81,-3.81; 3 -1.27,-3.81; 4 1.27,-3.81; 5 3.81,-3.81; 6 6.35,-3.81
1X16 = drill 0.914 long: 1 -19.05,0; 2 -16.51,0; 3 -13.97,0; 4 -11.43,0; 5 -8.89,0; 6 -6.35,0; 7 -3.81,0; 8 -1.27,0; 9 1.27,0; 10 3.81,0; 11 6.35,0; 12 8.89,0; 13 11.43,0; 14 13.97,0; 15 16.51,0; 16 19.05,0
JP1 = drill 0.914 long: 1 0,-1.27; 2 0,1.27
JP6Q = drill 0.914 octagon: 1 -6.35,-1.27; 2 -6.35,1.27; 3 -3.81,-1.27; 4 -3.81,1.27; 5 -1.27,-1.27; 6 -1.27,1.27; 7 1.27,-1.27; 8 1.27,1.27; 9 3.81,-1.27; 10 3.81,1.27; 11 6.35,-1.27; 12 6.35,1.27
JP2Q = drill 0.914 octagon: 1 -1.27,-1.27; 2 -1.27,1.27; 3 1.27,-1.27; 4 1.27,1.27
JP2 = drill 0.914 long: 1 -2.54,0; 2 0,0; 3 2.54,0
JP4Q = drill 0.914 octagon: 1 -3.81,-1.27; 2 -3.81,1.27; 3 -1.27,-1.27; 4 -1.27,1.27; 5 1.27,-1.27; 6 1.27,1.27; 7 3.81,-1.27; 8 3.81,1.27
JP3Q = drill 0.914 octagon: 1 -2.54,-1.27; 2 -2.54,1.27; 3 0,-1.27; 4 0,1.27; 5 2.54,-1.27; 6 2.54,1.27
LED5MM = drill 0.813 pad 1.422 octagon: A -1.27,0; K 1.27,0
PDV-P8103 = drill 0.8 pad 1.4 round: 1 -1.702,0; 2 1.702,0
TO92-EBC = drill 0.813 long: B 0,-1.27; C -2.54,-1.27; E 2.54,-1.27
0204/7 = drill 0.813 octagon: 1 -3.81,0; 2 3.81,0
3352T = drill 0.813 octagon: P$1 -2.54,0; P$2 0,0; P$3 2.54,0
PKM13EPY = drill 1 pad 2.184 octagon: P$1 2.5,0; P$2 -2.5,0
ELTS-6 = drill 1 pad 1.676 long: 1 -3.248,2.239; 2 -3.248,-2.239; 3 3.248,2.239; 4 3.248,-2.239
DIL8 = drill 0.813 long: 1 -3.81,-3.81; 2 -1.27,-3.81; 3 1.27,-3.81; 4 3.81,-3.81; 5 3.81,3.81; 6 1.27,3.81; 7 -1.27,3.81; 8 -3.81,3.81
DIL14' = drill 0.813 long: 1 -10.16,-3.81; 2 -7.62,-3.81; 3 -5.08,-3.81; 4 -2.54,-3.81; 5 0,-3.81; 6 2.54,-3.81; 7 5.08,-3.81; 8 5.08,3.81; 9 2.54,3.81; 10 0,3.81; 11 -2.54,3.81; 12 -5.08,3.81; 13 -7.62,3.81; 14 -10.16,3.81
TC26H = drill 0.813 round: 1 -1.27,0; 2 1.27,0
CSTLS_G9 = drill 0.813 long: 1 -2.5,0; 2 0,0; 3 2.5,0

### Placement (x,y rotation side)
C1  40.64,137.16 0 top
C2  6.99,119.38 270 top
C3  14.61,117.35 0 top
C4  14.61,114.3 0 top
C5  12.7,128.27 270 top
C6  7.11,127.63 270 top
C7  3.81,127.63 270 top
C8  110.49,99.06 270 top
C9  104.14,102.87 0 top
D1  120.65,125.73 90 top
DSP1  81.28,133.35 0 top
DSP2  93.98,133.35 0 top
DSP3  106.68,133.35 0 top
IC1  17.78,140.97 0 top
IC2  101.6,96.52 0 top
J1  120.65,138.43 270 top
JP1  41.91,148.59 0 top
JP2  39.37,62.23 0 top
JP3  19.05,94.61 90 top
JP4  58.42,134.62 90 top
JP5  58.42,122.56 90 top
JP6  81.28,120.65 0 top
JP7  19.05,83.19 90 top
JP8  59.69,116.84 270 top
JP9  59.69,112.39 270 top
JP10  59.69,107.95 270 top
JP11  101.6,74.93 0 top
JP12  110.49,74.93 0 top
JP13  119.38,74.93 0 top
JP14  119.38,92.71 0 top
JP15  119.38,110.49 0 top
JP16  92.71,74.93 0 top
JP17  83.82,74.93 0 top
JP18  74.93,74.93 0 top
JP19  66.04,74.93 0 top
JP20  21.59,124.46 0 top
JP21  21.59,106.68 180 top
JP22  29.21,130.81 270 top
JP23  54.61,82.55 90 top
JP24  15.24,76.83 0 top
JP25  93.98,83.19 0 top
JP26  64.77,99.06 90 top
JP27  73.66,97.79 90 top
L1  101.6,66.04 90 top
L2  110.49,66.04 90 top
L3  119.38,66.04 90 top
L4  119.38,83.82 90 top
L5  119.38,101.6 90 top
L6  92.71,66.04 90 top
L7  83.82,66.04 90 top
L8  74.93,66.04 90 top
L9  66.04,66.04 90 top
PH1  15.88,69.85 90 top
PH2  105.41,82.55 180 top
Q1  85.09,113.03 270 top
Q2  95.25,113.03 270 top
Q3  107.95,113.03 270 top
R1  21.59,97.79 180 top
R2  21.59,100.33 180 top
R3  67.94,140.97 0 top
R4  67.94,138.43 0 top
R5  67.94,135.89 0 top
R6  67.94,133.35 0 top
R7  67.94,130.81 0 top
R8  67.94,128.27 0 top
R9  67.94,123.83 0 top
R10  21.59,86.36 180 top
R11  72.39,116.84 0 top
R12  21.59,88.9 180 top
R13  72.39,112.39 0 top
R14  72.39,107.95 0 top
R15  99.06,73.66 270 top
R16  107.95,73.66 270 top
R17  116.84,73.66 270 top
R18  116.84,91.44 270 top
R19  116.84,109.22 270 top
R20  90.17,73.66 270 top
R21  81.28,73.66 270 top
R22  72.39,73.66 270 top
R23  63.5,73.66 270 top
R24  3.81,118.11 270 top
R25  6.35,140.97 90 top
R26  3.81,140.97 90 top
R27  104.14,90.17 0 top
R28  96.52,102.87 180 top
R29  91.44,100.33 0 top
R30  12.7,63.5 180 top
R31  104.14,87.63 0 top
RP1  85.09,91.44 0 top
RP2  7.62,67.31 0 top
SP1  64.77,87.63 90 top
SW1  7.62,100.33 90 top
SW2  7.62,87.63 90 top
U1  40.64,129.54 270 top
U2  PIC16F506  [DIL14']  40.64,109.22 270 top
Y1  19.05,119.38 180 top
Y2  24.13,115.57 270 top
Y3  5.08,133.35 270 top

### Tracks (layer width: path | path; a pad name or v marks a point on that pad's centre or on a via)
32KHZ
  Top 0.406: 27.94,132.08 JP22.1
  Top 0.61: 27.94,132.08 26.67,133.35 17.78,133.35 | 17.78,133.35 IC1.4 | JP22.1 27.94,124.46 26.67,123.19 JP20.7 | JP2.1 20.32,78.74 19.05,80.01 16.51,80.01 13.97,82.55 13.97,107.95 10.16,111.76 10.16,119.38 15.24,124.46 15.24,127 17.78,129.54 17.78,133.35
+5V
  pour Top (isolate 0.305): 0.64,149.22 128.91,149.22 128.91,0.63 0.64,0.63
A
  Bottom 0.61: DSP3.7 109.22,138.43 106.68,135.89 96.52,135.89 | R5.2 83.82,135.89 | 83.82,135.89 96.52,135.89 | 96.52,135.89 DSP2.7 | 83.82,135.89 DSP1.7
B
  Top 0.61: R6.2 86.36,133.35 | 86.36,133.35 DSP1.6 | 99.06,133.35 DSP2.6 | 86.36,133.35 99.06,133.35 | DSP3.6 111.76,135.89 109.22,133.35 99.06,133.35
C
  Top 0.61: R7.2 83.82,130.81 | 83.82,130.81 DSP1.4 | DSP3.4 109.22,128.27 106.68,130.81 96.52,130.81 | 83.82,130.81 96.52,130.81 | 96.52,130.81 DSP2.4
D
  Bottom 0.61: R8.2 78.74,128.27 | 78.74,128.27 91.44,128.27 | 91.44,128.27 102.87,128.27 104.14,127 DSP3.2 | 91.44,128.27 DSP2.2 | 78.74,128.27 DSP1.2
E
  Top 0.406: DSP3.1 101.6,124.46 100.97,123.83 88.9,123.83 | 88.9,123.83 DSP2.1 | R9.2 76.2,123.83 | 76.2,123.83 DSP1.1 | 76.2,123.83 88.9,123.83
F
  Top 0.61: R4.2 77.47,138.43 78.74,139.7 DSP1.9 78.74,142.24 80.01,143.51 91.44,143.51 | DSP3.9 104.14,142.24 102.87,143.51 91.44,143.51 | 91.44,143.51 DSP2.9
G
  Bottom 0.61: R3.2 DSP1.10 76.2,142.24 77.47,143.51 88.9,143.51 | DSP3.10 101.6,142.24 100.33,143.51 88.9,143.51 | 88.9,143.51 DSP2.10
GND
  pour Bottom (isolate 0.305, rank 2): 0.64,149.22 0.64,0.63 128.91,0.63 128.91,149.22
GP0/RB0
  Top 0.406: 38.1,99.06 39.37,100.33 39.37,110.49 40.64,111.76 40.64,114.94 42.55,116.84 U2.13
  Top 0.61: 38.1,99.06 JP2.8 38.1,58.42 | JP24.2 15.24,74.93 12.7,72.39 12.7,60.96 15.24,58.42 38.1,58.42 | L1.A 101.6,60.96 91.44,50.8 45.72,50.8 38.1,58.42 | JP4.12 54.61,140.97 48.26,134.62 48.26,125.73 | 48.26,125.73 U1.5 | U2.13 46.99,116.84 48.26,118.11 48.26,125.73
  Bottom 0.406: U1.5 42.55,125.73 41.91,126.36 41.91,130.18 40.64,131.44 JP1.3
GP1/RB1
  Top 0.406: 40.64,99.06 40.64,109.85 41.91,111.12 41.91,113.66 42.55,114.3 U2.12
  Top 0.61: JP2.9 40.64,99.06 | U2.12 48.26,114.3 50.8,116.84 50.8,133.35 55.88,138.43 JP4.10
  Bottom 0.406: U2.12 41.91,114.3 40.64,115.57 40.64,128.91 39.37,130.18 39.37,134.24 38.35,135.25 34.92,135.25 | 97.03,52.07 97.03,81.41 JP25.5
  Bottom 0.61: U1.4 34.92,125.73 33.66,127 33.66,133.99 34.92,135.25 34.92,139.06 38.1,142.24 JP1.2 | L2.A 110.49,60.96 101.6,52.07 97.03,52.07 48.26,52.07 40.64,59.69 JP2.9
GP2/RB2  (via drill 0.7)
  Top 0.61: U1.3 31.75,128.27 30.48,129.54 JP22.2 | L3.A 116.84,64.77 114.3,67.31 114.3,77.47 111.76,80.01 91.44,80.01 | 91.44,80.01 80.01,80.01 78.74,78.74 78.74,60.96 73.66,55.88 54.61,55.88 50.8,59.69 JP2.13 v50.8,95.25 50.8,111.76 | 50.8,111.76 U2.11 | 91.44,80.01 JP25.1 | JP5.4 55.88,123.83 53.34,121.28 53.34,114.3 50.8,111.76
  Bottom 0.406: U1.3 38.73,128.27 39.37,127.63 39.37,113.66 41.27,111.76 U2.11
  Bottom 0.61: v50.8,95.25 38.1,95.25 31.75,88.9 R12.1
GP3/RB3
  Top 0.406: U2.4 38.73,111.76 39.37,112.39 39.37,115.57 41.27,117.47 41.27,132.08 42.55,133.35 U1.8
  Top 0.61: U2.4 33.66,111.76 30.99,109.09 30.99,67.82 27.94,64.77 JP2.4
  Bottom 0.61: U1.8 46.99,133.35 48.26,134.62 JP1.6 | R2.1 33.02,107.95 33.02,110.49 34.29,111.76 U2.4
GP4/RB4
  Top 0.61: U2.3 33.02,114.3 29.46,110.74 29.46,68.83 25.4,64.77 JP2.3 | JP26.4 63.5,101.6 64.77,102.87 74.93,102.87 81.28,96.52 106.68,96.52 111.76,91.44 111.76,86.36 115.57,82.55 L4.A
  Bottom 0.406: JP21.2 22.86,96.52 24.13,95.25 27.94,95.25 30.48,97.79 50.8,97.79 54.61,101.6 54.61,118.75 JP5.2
  Bottom 0.61: JP21.4 JP21.2 25.4,105.41 34.29,114.3 U2.3 | JP2.3 25.4,68.58 46.99,90.17 52.07,90.17 62.23,100.33 JP26.4
GP5/RB5
  Top 0.61: U2.2 32.38,116.84 27.94,112.39 27.94,69.85 22.86,64.77 JP2.2
  Bottom 0.406: JP2.2 22.86,69.85 45.72,92.71 52.07,92.71 55.88,96.52 55.88,109.85 JP9.1
  Bottom 0.61: JP20.2 JP20.4 JP20.6 JP20.8 30.48,125.73 33.02,123.19 33.02,118.11 34.29,116.84 U2.2 | L5.A 124.46,95.25 124.46,60.96 113.03,49.53 33.02,49.53 22.86,59.69 JP2.2
N$1
  Bottom 0.61: SW1.2 9.86,100.33 | 9.86,100.33 SW1.4 | 9.86,100.33 R2.2 19.05,100.33 20.32,99.06 JP3.1
N$2
  Top 0.61: L1.K JP11.1
N$3
  Top 0.61: L2.K JP12.1
N$4
  Bottom 0.61: SW2.2 9.86,88.9 | 9.86,88.9 SW2.4 | 9.86,88.9 R12.2 19.05,88.9 20.32,87.63 JP7.1
N$5
  Bottom 0.61: JP3.2 R1.2
N$6
  Top 0.61: L3.K JP13.1
N$7
  Bottom 0.61: JP11.2 100.33,76.2 R15.1
N$8
  Bottom 0.61: JP12.2 109.22,76.2 R16.1
N$9
  Bottom 0.61: JP13.2 118.11,76.2 R17.1
N$10
  Bottom 0.61: JP7.2 R10.2
N$11
  Bottom 0.61: IC1.2 IC1.3 | R26.2 R25.2 6.35,142.24 7.62,140.97 11.43,140.97 12.7,139.7 IC1.2 | C5.1 IC1.2
N$12
  Bottom 0.61: IC1.1 R25.1 6.35,134.62 | 6.35,134.62 Y3.1 | C6.1 7.11,133.86 6.35,134.62
N$13
  Bottom 0.61: R26.1 2.54,135.89 2.54,133.35 3.81,132.08 | 3.81,132.08 Y3.2 | C7.1 3.81,132.08
N$14
  Top 0.61: 20.32,114.3 JP21.3 | 20.32,114.3 Y1.1 | C4.2 20.32,114.3
N$15
  Bottom 0.61: JP20.1 16.51,121.92 C2.1 R24.1
N$16
  Top 0.61: JP20.3 17.78,120.65 Y1.2 17.78,119.25 C3.2
N$17
  Top 0.61: JP21.1 22.86,110.49 24.13,111.76 Y2.3
N$18
  Top 0.61: JP20.5 22.86,120.65 24.13,119.38 Y2.1
N$19
  Bottom 0.61: JP4.11 R3.1
N$20
  Bottom 0.61: JP4.9 R4.1
N$21
  Bottom 0.61: JP4.7 R5.1
N$22
  Bottom 0.61: JP4.5 R6.1
N$23
  Bottom 0.61: JP4.3 R7.1
N$24
  Bottom 0.61: JP4.1 R8.1
N$25
  Bottom 0.61: JP5.1 JP5.3 R9.1
N$26
  Bottom 0.61: JP6.2 DSP1.3
N$27
  Bottom 0.61: Q1.C JP6.3
N$28
  Bottom 0.61: JP8.2 R11.1
N$29
  Bottom 0.61: R11.2 77.47,116.84 81.28,113.03 Q1.B
N$30
  Bottom 0.61: Q2.C DSP2.3
N$31
  Bottom 0.61: JP9.2 R13.1
N$32
  Top 0.61: R13.2 77.47,112.39 81.92,107.95 86.36,107.95 91.44,113.03 Q2.B
N$33
  Bottom 0.61: Q3.C DSP3.3
N$34
  Bottom 0.61: JP10.2 R14.1
N$35
  Bottom 0.61: R14.2 99.06,107.95 104.14,113.03 Q3.B
N$36
  Bottom 0.406: 17.78,71.12 17.35,71.55
  Bottom 0.61: R30.1 17.78,64.77 17.78,71.12 JP24.3 | 17.35,71.55 PH1.2
N$37
  Bottom 0.61: JP24.1 12.7,74.93 7.62,69.85 RP2.P$2
N$38
  Top 0.61: L6.K JP16.1
N$39
  Bottom 0.61: JP16.2 91.44,76.2 R20.1
N$40
  Top 0.61: L7.K JP17.1
N$41
  Bottom 0.61: JP17.2 82.55,76.2 R21.1
N$42
  Top 0.61: L8.K JP18.1
N$43
  Bottom 0.61: JP18.2 73.66,76.2 R22.1
N$44
  Top 0.61: L9.K JP19.1
N$45
  Bottom 0.61: JP19.2 64.77,76.2 R23.1
N$46
  Bottom 0.61: JP14.2 118.11,93.98 R18.1
N$47
  Top 0.61: L4.K JP14.1
N$48
  Bottom 0.61: JP15.2 118.11,111.76 R19.1
N$49
  Top 0.61: L5.K JP15.1
N$50
  Bottom 0.406: 64.73,85.09 SP1.P$2
  Bottom 0.61: 64.73,85.09 60.96,85.09 58.42,82.55 JP23.2
N$51
  Bottom 0.61: PH2.2 102.23,82.55 100.33,84.45 | 100.33,84.45 R31.1 | JP25.2 JP25.4 JP25.6 100.33,84.45
N$52
  Bottom 0.61: IC2.5 C8.1
N$53
  Bottom 0.61: RP1.P$1 RP1.P$2 85.09,97.79 R29.1
N$54
  Top 0.61: RP1.P$3 87.63,92.71 86.36,93.98 76.2,93.98 74.93,95.25 JP27.1
  Bottom 0.61: C9.1 IC2.6 102.87,97.79 100.33,95.25 | 100.33,95.25 IC2.2 | RP1.P$3 91.44,95.25 100.33,95.25
N$55
  Top 1.016: D1.A J1.3
N$56
  Bottom 0.61: IC2.7 R28.1 96.52,102.87 95.25,101.6 R29.2
RC0
  Top 0.406: 43.18,99.06 41.91,100.33 41.91,108.59 42.55,109.22 U2.10
  Top 0.61: JP2.10 43.18,99.06
  Bottom 0.406: L6.A 93.98,64.77 95.5,66.29 95.5,78.49 93.98,80.01 JP25.3
  Bottom 0.61: L6.A 92.71,60.96 86.36,54.61 48.26,54.61 43.18,59.69 JP2.10 43.18,67.31 52.07,76.2 58.42,76.2 62.23,80.01 66.04,80.01 72.39,86.36 JP27.2 72.39,100.33 68.58,104.14 59.69,104.14 58.42,105.41 JP10.1
RC1
  Top 0.61: U2.9 46.35,106.68 48.26,104.78 JP2.12 48.26,59.69 54.61,53.34 76.2,53.34 83.82,60.96 L7.A
  Bottom 0.406: U2.9 46.99,106.68 49.53,109.22 49.53,130.81 54.61,135.89 JP4.8
RC2
  Top 0.61: JP2.11 45.72,104.14 U2.8
  Bottom 0.406: U2.8 46.99,104.14 50.8,107.95 50.8,129.54 54.61,133.35 JP4.6
  Bottom 0.61: L8.A 74.93,60.96 71.12,57.15 48.26,57.15 45.72,59.69 JP2.11
RC3
  Top 0.61: U2.7 35.56,104.14 JP2.7
  Bottom 0.406: U2.7 38.73,104.14 39.37,103.5 39.37,102.23 41.91,99.69 49.53,99.69 53.34,103.5 53.34,124.46 54.86,125.98 57.15,125.98
  Bottom 0.61: L9.A 67.31,64.77 69.85,67.31 69.85,78.74 77.47,86.36 77.47,101.6 72.39,106.68 72.39,119.38 65.53,125.98 57.15,125.98 JP4.2
RC4
  Top 0.61: U2.6 34.92,106.68 34.04,105.79 34.04,65.79 33.02,64.77 JP2.6
  Bottom 0.406: U2.6 40.01,106.68 41.27,105.41 41.27,102.87 42.55,101.6 48.26,101.6 52.07,105.41 52.07,128.27 54.61,130.81 JP4.4
  Bottom 0.61: JP2.6 33.02,67.31 50.8,85.09 JP23.3
RC5
  Top 0.61: U2.5 34.29,109.22 32.51,107.44 32.51,66.8 30.48,64.77 JP2.5 | JP8.1 57.15,116.84 55.88,115.57 55.88,100.33 58.42,97.79 JP26.2
  Bottom 0.406: 64.73,90.17 SP1.P$1
  Bottom 0.61: JP2.5 30.48,68.58 49.53,87.63 52.07,87.63 54.61,90.17 | 54.61,90.17 64.73,90.17 | 54.61,90.17 62.23,97.79 JP26.2
VAR_FREQ
  Top 0.61: R27.1 90.17,90.17 86.36,86.36 69.85,86.36 | JP2.14 53.34,59.69 54.61,58.42 67.31,58.42 69.85,60.96 69.85,86.36 | JP26.1 69.85,93.98 69.85,86.36
  Bottom 0.61: JP26.1 JP26.3 | IC2.3 102.87,91.44 101.6,90.17 R27.1

### Text on the board
tPlace: Breadboard area
tDocu: 3V-6V | + | 1 | RA/RB0 | G | - | RA/RB1 | F | RC1 | A | RC2 | B | T0CKI | RC4 | C | 10F | RC3 | D | RC | 32kHz | 4MHz | EC | RA/RB2 | E | Clock | RA/RB4 | GND | RC5 | RC5 | Dig1 | 12F | RA/RB5 | Dig2 | RC0 | Dig3 | !MCLR | 16F | 32kHz | 4MHz | Variable Freq | GP5 | GP3 | !T1G | C2IN+ | RA5 | RA3 | Freq | CCP1 | RB5 | RB3 | Gooligum | Electronics | GP2 | RA2 | Piezo | AN2 | C2IN+ | C1IN- | P1B | LDR2 | RB2 | GP4 | RA4 | RB4 | GND | POT | LDR1 | AN0/C1IN+ | 32 kHz | GP/RA/RB5 | GP/RA/RB4 | GP/RA/RB3 | RC5 | RC4 | RC3 | GP/RA/RB0 | GP/RA/RB1 | RC0 | RC2 | RC1 | GP/RA/RB2 | Var Freq | +V | GND | 1 | RC3 | RC2 | RC1 | RC0 | GP0 | GP1 | GP2 | RA0 | RA1 | RA2 | RB0 | RB1 | RB2 | Baseline and | midrange PIC | (6 - 14 pin) | Training and | development board | www.gooligum.com.au | Rev 1.6 1/6/13 | (c) 2013 Gooligum Electronics